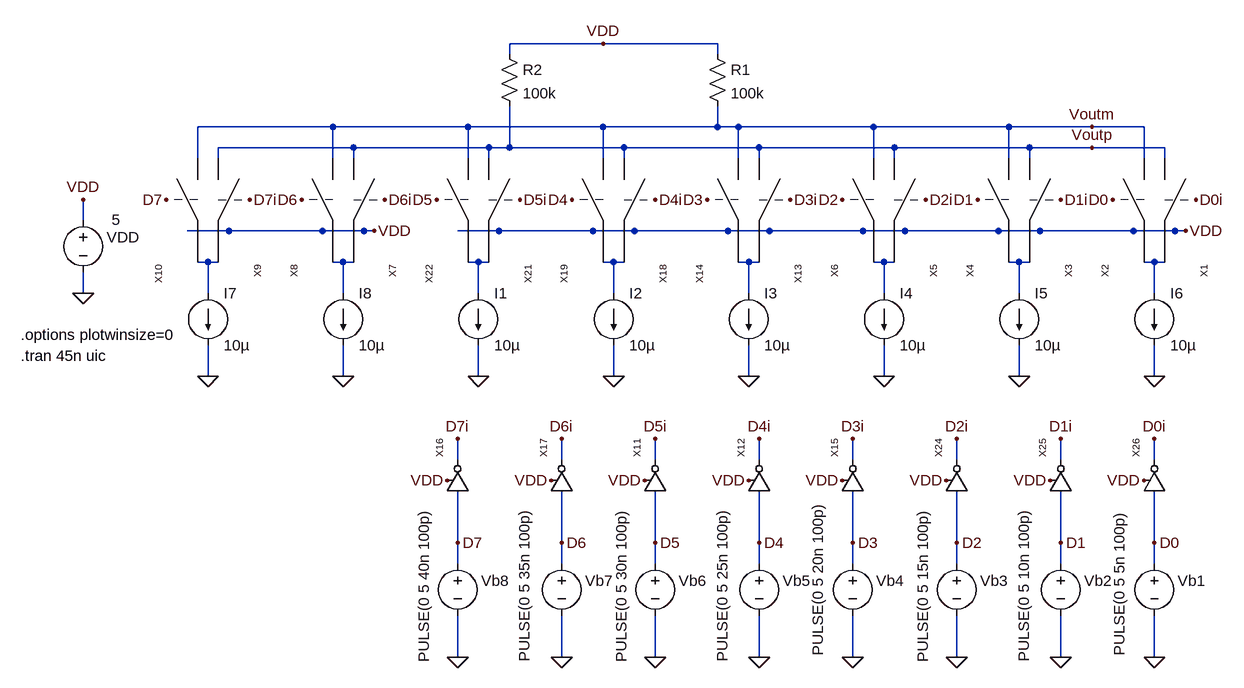
[diagram p0: schematic Fig29_9.asc]
Fig29_9.asc, the LTspice schematic file:
Version 4
SHEET 1 3340 2148
WIRE 1552 928 1408 928
WIRE 1728 928 1552 928
WIRE 1408 944 1408 928
WIRE 1728 944 1728 928
WIRE 1136 1056 928 1056
WIRE 1344 1056 1136 1056
WIRE 1552 1056 1344 1056
WIRE 1728 1056 1728 1024
WIRE 1728 1056 1552 1056
WIRE 1760 1056 1728 1056
WIRE 1968 1056 1760 1056
WIRE 2176 1056 1968 1056
WIRE 2304 1056 2176 1056
WIRE 2384 1056 2304 1056
WIRE 1168 1088 960 1088
WIRE 1376 1088 1168 1088
WIRE 1408 1088 1408 1024
WIRE 1408 1088 1376 1088
WIRE 1584 1088 1408 1088
WIRE 1792 1088 1584 1088
WIRE 2000 1088 1792 1088
WIRE 2208 1088 2000 1088
WIRE 2304 1088 2208 1088
WIRE 2416 1088 2304 1088
WIRE 928 1104 928 1056
WIRE 960 1104 960 1088
WIRE 1136 1104 1136 1056
WIRE 1168 1104 1168 1088
WIRE 1344 1104 1344 1056
WIRE 1376 1104 1376 1088
WIRE 1552 1104 1552 1056
WIRE 1584 1104 1584 1088
WIRE 1760 1104 1760 1056
WIRE 1792 1104 1792 1088
WIRE 1968 1104 1968 1056
WIRE 2000 1104 2000 1088
WIRE 2176 1104 2176 1056
WIRE 2208 1104 2208 1088
WIRE 2384 1104 2384 1056
WIRE 2416 1104 2416 1088
WIRE 752 1200 752 1168
WIRE 976 1216 912 1216
WIRE 1120 1216 976 1216
WIRE 1184 1216 1120 1216
WIRE 1200 1216 1184 1216
WIRE 1392 1216 1328 1216
WIRE 1536 1216 1392 1216
WIRE 1600 1216 1536 1216
WIRE 1744 1216 1600 1216
WIRE 1808 1216 1744 1216
WIRE 1952 1216 1808 1216
WIRE 2016 1216 1952 1216
WIRE 2160 1216 2016 1216
WIRE 2224 1216 2160 1216
WIRE 2368 1216 2224 1216
WIRE 2432 1216 2368 1216
WIRE 2448 1216 2432 1216
WIRE 944 1264 928 1264
WIRE 960 1264 944 1264
WIRE 1152 1264 1136 1264
WIRE 1168 1264 1152 1264
WIRE 1360 1264 1344 1264
WIRE 1376 1264 1360 1264
WIRE 1568 1264 1552 1264
WIRE 1584 1264 1568 1264
WIRE 1776 1264 1760 1264
WIRE 1792 1264 1776 1264
WIRE 1984 1264 1968 1264
WIRE 2000 1264 1984 1264
WIRE 2192 1264 2176 1264
WIRE 2208 1264 2192 1264
WIRE 2400 1264 2384 1264
WIRE 2416 1264 2400 1264
WIRE 752 1312 752 1280
WIRE 944 1312 944 1264
WIRE 1152 1312 1152 1264
WIRE 1360 1312 1360 1264
WIRE 1568 1312 1568 1264
WIRE 1776 1312 1776 1264
WIRE 1984 1312 1984 1264
WIRE 2192 1312 2192 1264
WIRE 2400 1312 2400 1264
WIRE 944 1440 944 1392
WIRE 1152 1440 1152 1392
WIRE 1360 1440 1360 1392
WIRE 1568 1440 1568 1392
WIRE 1776 1440 1776 1392
WIRE 1984 1440 1984 1392
WIRE 2192 1440 2192 1392
WIRE 2400 1440 2400 1392
WIRE 1328 1568 1328 1536
WIRE 1488 1568 1488 1536
WIRE 1632 1568 1632 1536
WIRE 1792 1568 1792 1536
WIRE 1936 1568 1936 1536
WIRE 2096 1568 2096 1536
WIRE 2256 1568 2256 1536
WIRE 2400 1568 2400 1536
WIRE 1328 1696 1328 1616
WIRE 1488 1696 1488 1616
WIRE 1632 1696 1632 1616
WIRE 1792 1696 1792 1616
WIRE 1936 1696 1936 1616
WIRE 2096 1696 2096 1616
WIRE 2256 1696 2256 1616
WIRE 2400 1696 2400 1616
WIRE 1328 1728 1328 1696
WIRE 1488 1728 1488 1696
WIRE 1632 1728 1632 1696
WIRE 1792 1728 1792 1696
WIRE 1936 1728 1936 1696
WIRE 2096 1728 2096 1696
WIRE 2256 1728 2256 1696
WIRE 2400 1728 2400 1696
WIRE 1328 1872 1328 1808
WIRE 1488 1872 1488 1808
WIRE 1632 1872 1632 1808
WIRE 1792 1872 1792 1808
WIRE 1936 1872 1936 1808
WIRE 2096 1872 2096 1808
WIRE 2256 1872 2256 1808
WIRE 2400 1872 2400 1808
FLAG 752 1312 0
FLAG 752 1168 VDD
FLAG 1712 1168 D3
FLAG 1840 1168 D3i
FLAG 1504 1168 D4
FLAG 1632 1168 D4i
FLAG 1296 1168 D5
FLAG 1424 1168 D5i
FLAG 2400 1872 0
FLAG 2256 1872 0
FLAG 2096 1872 0
FLAG 2400 1696 D0
FLAG 2256 1696 D1
FLAG 2096 1696 D2
FLAG 2080 1600 VDD
FLAG 2096 1536 D2i
FLAG 2240 1600 VDD
FLAG 2256 1536 D1i
FLAG 2384 1600 VDD
FLAG 2400 1536 D0i
FLAG 1360 1440 0
FLAG 1568 1440 0
FLAG 1776 1440 0
FLAG 1552 928 VDD
FLAG 2304 1056 Voutm
FLAG 2304 1088 Voutp
FLAG 2336 1168 D0
FLAG 2464 1168 D0i
FLAG 2128 1168 D1
FLAG 2256 1168 D1i
FLAG 1920 1168 D2
FLAG 2048 1168 D2i
FLAG 2448 1216 VDD
FLAG 1984 1440 0
FLAG 2192 1440 0
FLAG 2400 1440 0
FLAG 1088 1168 D6
FLAG 1216 1168 D6i
FLAG 880 1168 D7
FLAG 1008 1168 D7i
FLAG 1200 1216 VDD
FLAG 944 1440 0
FLAG 1152 1440 0
FLAG 1936 1872 0
FLAG 1792 1872 0
FLAG 1632 1872 0
FLAG 1936 1696 D3
FLAG 1792 1696 D4
FLAG 1632 1696 D5
FLAG 1616 1600 VDD
FLAG 1632 1536 D5i
FLAG 1776 1600 VDD
FLAG 1792 1536 D4i
FLAG 1920 1600 VDD
FLAG 1936 1536 D3i
FLAG 1488 1872 0
FLAG 1328 1872 0
FLAG 1488 1696 D6
FLAG 1328 1696 D7
FLAG 1312 1600 VDD
FLAG 1328 1536 D7i
FLAG 1472 1600 VDD
FLAG 1488 1536 D6i
SYMBOL voltage 752 1184 R0
WINDOW 0 36 42 Left 0
WINDOW 3 44 15 Left 0
WINDOW 123 0 0 Left 0
WINDOW 39 0 0 Left 0
SYMATTR InstName VDD
SYMATTR Value 5
SYMBOL switch_1 1776 1104 R90
SYMATTR InstName X13
SYMBOL switch_1 1776 1104 M90
SYMATTR InstName X14
SYMBOL switch_1 1568 1104 R90
SYMATTR InstName X18
SYMBOL switch_1 1568 1104 M90
SYMATTR InstName X19
SYMBOL switch_1 1360 1104 R90
SYMATTR InstName X21
SYMBOL switch_1 1360 1104 M90
SYMATTR InstName X22
SYMBOL voltage 2400 1712 R0
WINDOW 0 36 42 Left 0
WINDOW 3 -54 158 VLeft 0
WINDOW 123 0 0 Left 0
WINDOW 39 0 0 Left 0
SYMATTR InstName Vb1
SYMATTR Value PULSE(0 5 5n 100p)
SYMBOL voltage 2256 1712 R0
WINDOW 0 36 42 Left 0
WINDOW 3 -57 167 VLeft 0
WINDOW 123 0 0 Left 0
WINDOW 39 0 0 Left 0
SYMATTR InstName Vb2
SYMATTR Value PULSE(0 5 10n 100p)
SYMBOL voltage 2096 1712 R0
WINDOW 0 36 42 Left 0
WINDOW 3 -52 168 VLeft 0
WINDOW 123 0 0 Left 0
WINDOW 39 0 0 Left 0
SYMATTR InstName Vb3
SYMATTR Value PULSE(0 5 15n 100p)
SYMBOL inverter 2096 1616 R270
SYMATTR InstName X24
SYMBOL inverter 2256 1616 R270
SYMATTR InstName X25
SYMBOL inverter 2400 1616 R270
SYMATTR InstName X26
SYMBOL current 1360 1312 R0
SYMATTR InstName I1
SYMATTR Value 10µ
SYMBOL current 1568 1312 R0
SYMATTR InstName I2
SYMATTR Value 10µ
SYMBOL current 1776 1312 R0
SYMATTR InstName I3
SYMATTR Value 10µ
SYMBOL res 1712 928 R0
SYMATTR InstName R1
SYMATTR Value 100k
SYMBOL res 1392 928 R0
SYMATTR InstName R2
SYMATTR Value 100k
SYMBOL switch_1 2400 1104 R90
SYMATTR InstName X1
SYMBOL switch_1 2400 1104 M90
SYMATTR InstName X2
SYMBOL switch_1 2192 1104 R90
SYMATTR InstName X3
SYMBOL switch_1 2192 1104 M90
SYMATTR InstName X4
SYMBOL switch_1 1984 1104 R90
SYMATTR InstName X5
SYMBOL switch_1 1984 1104 M90
SYMATTR InstName X6
SYMBOL current 1984 1312 R0
SYMATTR InstName I4
SYMATTR Value 10µ
SYMBOL current 2192 1312 R0
SYMATTR InstName I5
SYMATTR Value 10µ
SYMBOL current 2400 1312 R0
SYMATTR InstName I6
SYMATTR Value 10µ
SYMBOL switch_1 1152 1104 R90
SYMATTR InstName X7
SYMBOL switch_1 1152 1104 M90
SYMATTR InstName X8
SYMBOL switch_1 944 1104 R90
SYMATTR InstName X9
SYMBOL switch_1 944 1104 M90
SYMATTR InstName X10
SYMBOL current 944 1312 R0
SYMATTR InstName I7
SYMATTR Value 10µ
SYMBOL current 1152 1312 R0
SYMATTR InstName I8
SYMATTR Value 10µ
SYMBOL voltage 1936 1712 R0
WINDOW 0 36 42 Left 0
WINDOW 3 -54 158 VLeft 0
WINDOW 123 0 0 Left 0
WINDOW 39 0 0 Left 0
SYMATTR InstName Vb4
SYMATTR Value PULSE(0 5 20n 100p)
SYMBOL voltage 1792 1712 R0
WINDOW 0 36 42 Left 0
WINDOW 3 -57 167 VLeft 0
WINDOW 123 0 0 Left 0
WINDOW 39 0 0 Left 0
SYMATTR InstName Vb5
SYMATTR Value PULSE(0 5 25n 100p)
SYMBOL voltage 1632 1712 R0
WINDOW 0 36 42 Left 0
WINDOW 3 -52 168 VLeft 0
WINDOW 123 0 0 Left 0
WINDOW 39 0 0 Left 0
SYMATTR InstName Vb6
SYMATTR Value PULSE(0 5 30n 100p)
SYMBOL inverter 1632 1616 R270
SYMATTR InstName X11
SYMBOL inverter 1792 1616 R270
SYMATTR InstName X12
SYMBOL inverter 1936 1616 R270
SYMATTR InstName X15
SYMBOL voltage 1488 1712 R0
WINDOW 0 36 42 Left 0
WINDOW 3 -57 167 VLeft 0
WINDOW 123 0 0 Left 0
WINDOW 39 0 0 Left 0
SYMATTR InstName Vb7
SYMATTR Value PULSE(0 5 35n 100p)
SYMBOL voltage 1328 1712 R0
WINDOW 0 36 42 Left 0
WINDOW 3 -52 168 VLeft 0
WINDOW 123 0 0 Left 0
WINDOW 39 0 0 Left 0
SYMATTR InstName Vb8
SYMATTR Value PULSE(0 5 40n 100p)
SYMBOL inverter 1328 1616 R270
SYMATTR InstName X16
SYMBOL inverter 1488 1616 R270
SYMATTR InstName X17
TEXT 656 1408 Left 0 !.tran 45n uic
TEXT 656 1376 Left 0 !.options plotwinsize=0

The netlist it stands for:
* Fig29_9.asc
VDD VDD 0 5
XX13 Voutp N005 D3i VDD switch_1  ; pins P1 P2 clk VDD
XX14 Voutm N005 D3 VDD switch_1  ; pins P1 P2 clk VDD
XX18 Voutp N004 D4i VDD switch_1  ; pins P1 P2 clk VDD
XX19 Voutm N004 D4 VDD switch_1  ; pins P1 P2 clk VDD
XX21 Voutp N003 D5i VDD switch_1  ; pins P1 P2 clk VDD
XX22 Voutm N003 D5 VDD switch_1  ; pins P1 P2 clk VDD
Vb1 D0 0 PULSE(0 5 5n 100p)
Vb2 D1 0 PULSE(0 5 10n 100p)
Vb3 D2 0 PULSE(0 5 15n 100p)
XX24 D2 D2i VDD inverter  ; pins In Out VDD
XX25 D1 D1i VDD inverter  ; pins In Out VDD
XX26 D0 D0i VDD inverter  ; pins In Out VDD
I1 N003 0 10µ
I2 N004 0 10µ
I3 N005 0 10µ
R1 VDD Voutm 100k
R2 VDD Voutp 100k
XX1 Voutp N008 D0i VDD switch_1  ; pins P1 P2 clk VDD
XX2 Voutm N008 D0 VDD switch_1  ; pins P1 P2 clk VDD
XX3 Voutp N007 D1i VDD switch_1  ; pins P1 P2 clk VDD
XX4 Voutm N007 D1 VDD switch_1  ; pins P1 P2 clk VDD
XX5 Voutp N006 D2i VDD switch_1  ; pins P1 P2 clk VDD
XX6 Voutm N006 D2 VDD switch_1  ; pins P1 P2 clk VDD
I4 N006 0 10µ
I5 N007 0 10µ
I6 N008 0 10µ
XX7 Voutp N002 D6i VDD switch_1  ; pins P1 P2 clk VDD
XX8 Voutm N002 D6 VDD switch_1  ; pins P1 P2 clk VDD
XX9 Voutp N001 D7i VDD switch_1  ; pins P1 P2 clk VDD
XX10 Voutm N001 D7 VDD switch_1  ; pins P1 P2 clk VDD
I7 N001 0 10µ
I8 N002 0 10µ
Vb4 D3 0 PULSE(0 5 20n 100p)
Vb5 D4 0 PULSE(0 5 25n 100p)
Vb6 D5 0 PULSE(0 5 30n 100p)
XX11 D5 D5i VDD inverter  ; pins In Out VDD
XX12 D4 D4i VDD inverter  ; pins In Out VDD
XX15 D3 D3i VDD inverter  ; pins In Out VDD
Vb7 D6 0 PULSE(0 5 35n 100p)
Vb8 D7 0 PULSE(0 5 40n 100p)
XX16 D7 D7i VDD inverter  ; pins In Out VDD
XX17 D6 D6i VDD inverter  ; pins In Out VDD
.tran 45n uic
.options plotwinsize=0
.backanno
.end